# EAGLE design MCDU_Board (EAGLE 7.5.0)
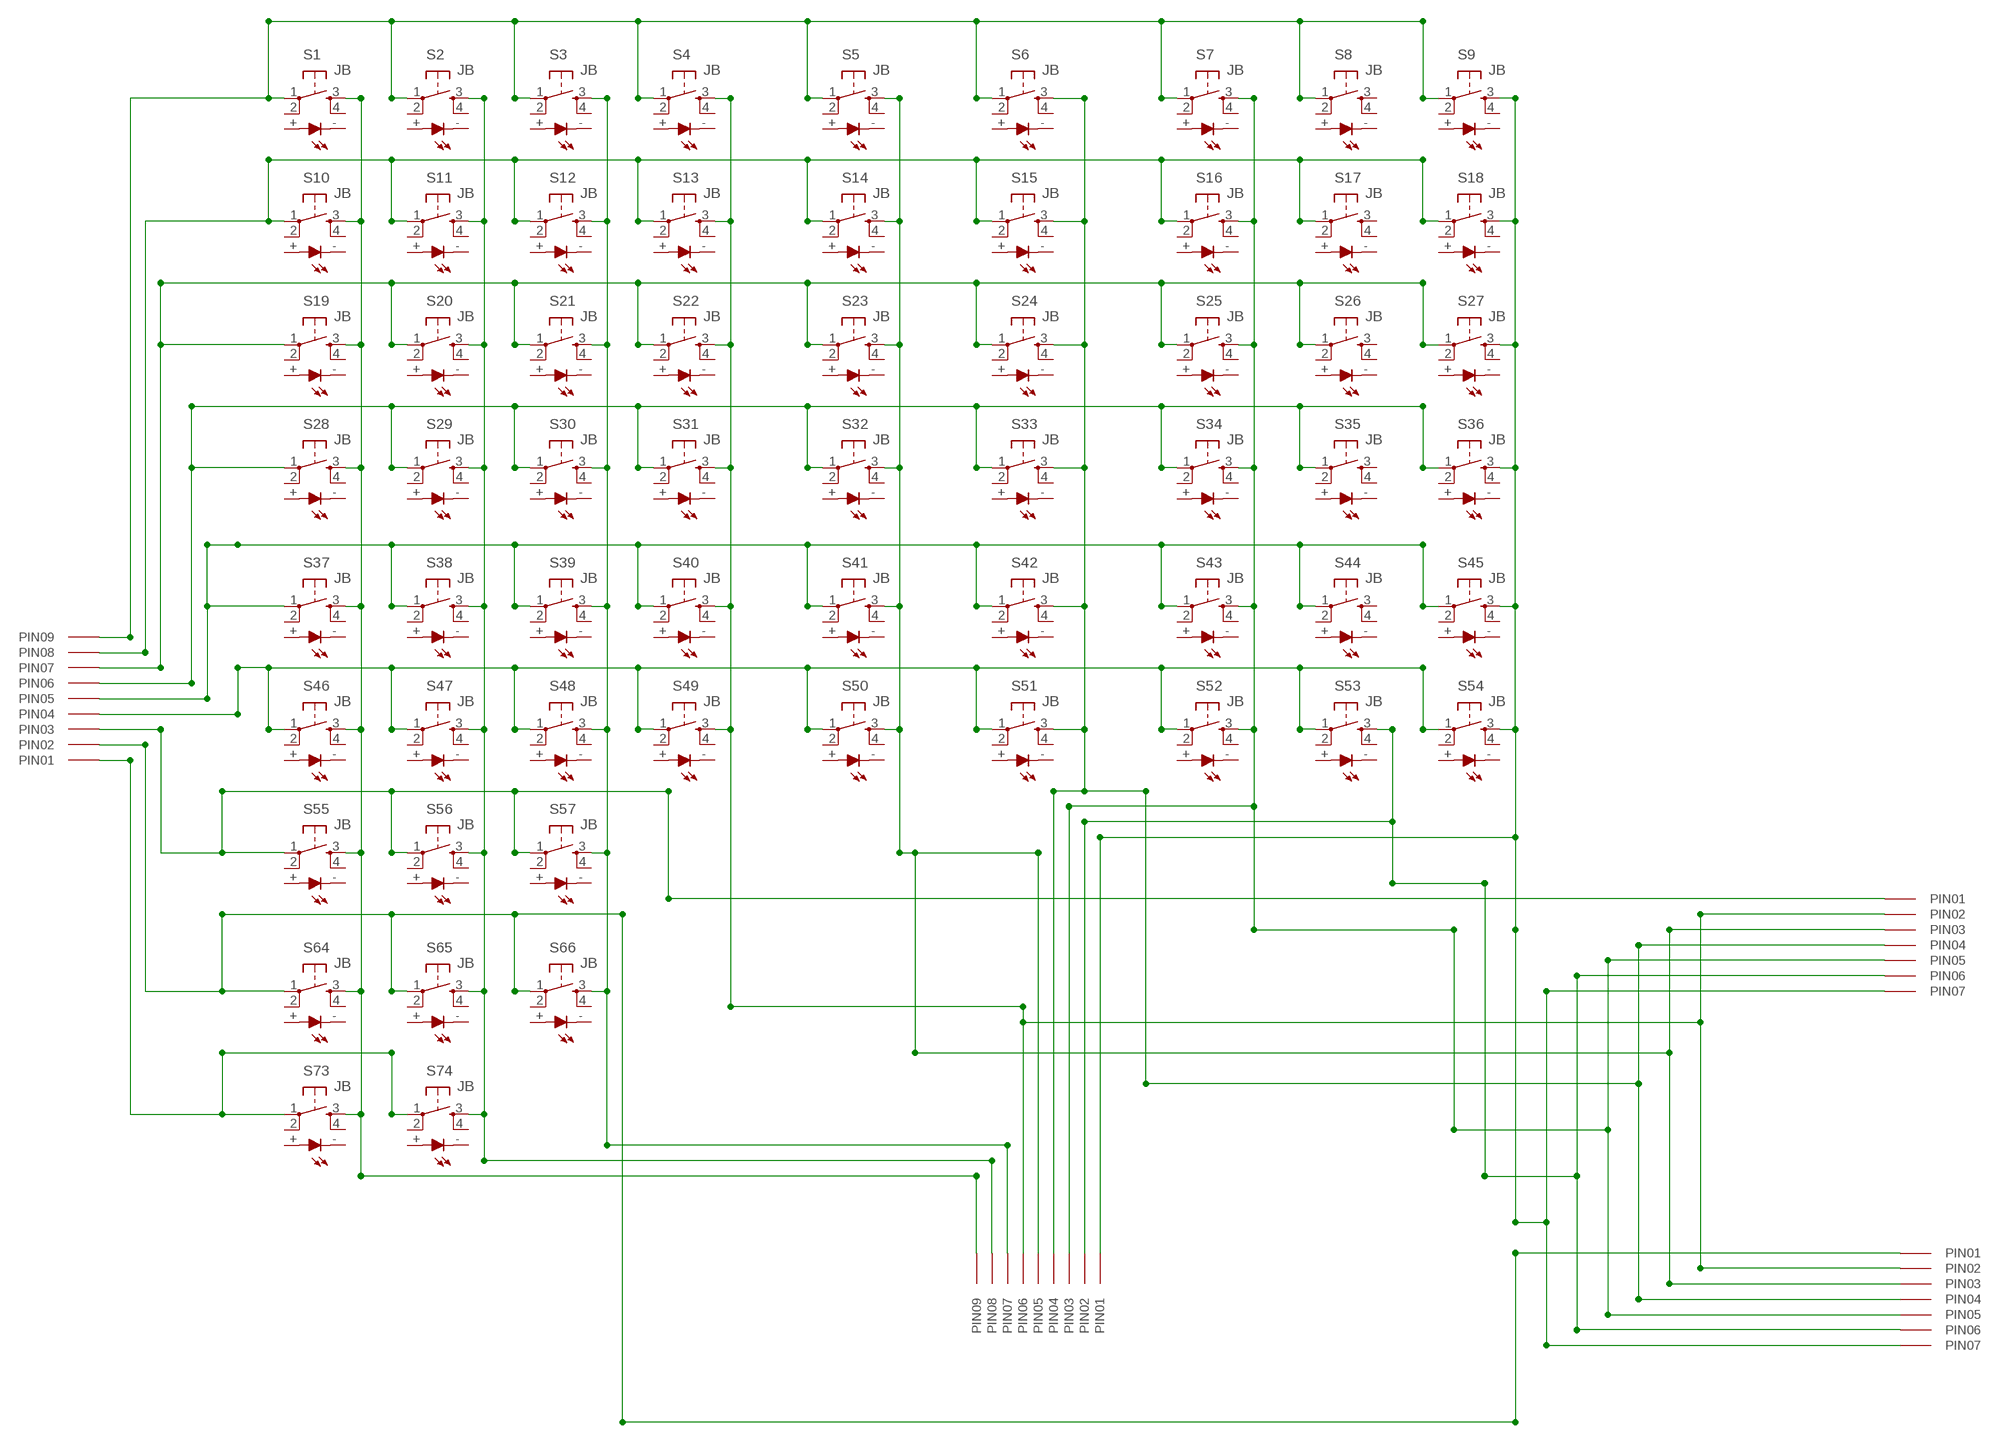
[diagram p0: schematic, sheet 1]

## Parts
S1  JB  [JB]
S2  JB  [JB]
S3  JB  [JB]
S4  JB  [JB]
S5  JB  [JB]
S6  JB  [JB]
S7  JB  [JB]
S8  JB  [JB]
S9  JB  [JB]
S10  JB  [JB]
S11  JB  [JB]
S12  JB  [JB]
S13  JB  [JB]
S14  JB  [JB]
S15  JB  [JB]
S16  JB  [JB]
S17  JB  [JB]
S18  JB  [JB]
S19  JB  [JB]
S20  JB  [JB]
S21  JB  [JB]
S22  JB  [JB]
S23  JB  [JB]
S24  JB  [JB]
S25  JB  [JB]
S26  JB  [JB]
S27  JB  [JB]
S28  JB  [JB]
S29  JB  [JB]
S30  JB  [JB]
S31  JB  [JB]
S32  JB  [JB]
S33  JB  [JB]
S34  JB  [JB]
S35  JB  [JB]
S36  JB  [JB]
S37  JB  [JB]
S38  JB  [JB]
S39  JB  [JB]
S40  JB  [JB]
S41  JB  [JB]
S42  JB  [JB]
S43  JB  [JB]
S44  JB  [JB]
S45  JB  [JB]
S46  JB  [JB]
S47  JB  [JB]
S48  JB  [JB]
S49  JB  [JB]
S50  JB  [JB]
S51  JB  [JB]
S52  JB  [JB]
S53  JB  [JB]
S54  JB  [JB]
S55  JB  [JB]
S56  JB  [JB]
S57  JB  [JB]
S64  JB  [JB]
S65  JB  [JB]
S66  JB  [JB]
S73  JB  [JB]
S74  JB  [JB]
U$1  09PINOS  [09PINOS]
U$2  07PINOS  [07PINOS]
U$3  07PINOS  [07PINOS]
U$4  09PINOS  [09PINOS]

## Nets
N$1: S1.1(P) S2.1(P) S3.1(P) S4.1(P) S5.1(P) S6.1(P) S7.1(P) S8.1(P) S9.1(P) U$1.PIN09
N$2: S10.1(P) S11.1(P) S12.1(P) S13.1(P) S14.1(P) S15.1(P) S16.1(P) S17.1(P) S18.1(P) U$1.PIN08
N$3: S19.1(P) S20.1(P) S21.1(P) S22.1(P) S23.1(P) S24.1(P) S25.1(P) S26.1(P) S27.1(P) U$1.PIN07
N$4: S28.1(P) S29.1(P) S30.1(P) S31.1(P) S32.1(P) S33.1(P) S34.1(P) S35.1(P) S36.1(P) U$1.PIN06
N$5: S37.1(P) S38.1(P) S39.1(P) S40.1(P) S41.1(P) S42.1(P) S43.1(P) S44.1(P) S45.1(P) U$1.PIN05
N$6: S46.1(P) S47.1(P) S48.1(P) S49.1(P) S50.1(P) S51.1(P) S52.1(P) S53.1(P) S54.1(P) U$1.PIN04
N$8: S1.3(S) S10.3(S) S19.3(S) S28.3(S) S37.3(S) S46.3(S) S55.3(S) S64.3(S) S73.3(S) U$4.PIN09
N$9: S73.1(P) S74.1(P) U$1.PIN01
N$11: S2.3(S) S11.3(S) S20.3(S) S29.3(S) S38.3(S) S47.3(S) S56.3(S) S65.3(S) S74.3(S) U$4.PIN08
N$12: S3.3(S) S12.3(S) S21.3(S) S30.3(S) S39.3(S) S48.3(S) S57.3(S) S66.3(S) U$4.PIN07
N$13: S4.3(S) S13.3(S) S22.3(S) S31.3(S) S40.3(S) S49.3(S) U$2.PIN02 U$3.PIN02 U$4.PIN06
N$14: S5.3(S) S14.3(S) S23.3(S) S32.3(S) S41.3(S) S50.3(S) U$2.PIN03 U$3.PIN03 U$4.PIN05
N$16: S7.3(S) S16.3(S) S25.3(S) S34.3(S) S43.3(S) S52.3(S) U$2.PIN05 U$3.PIN05 U$4.PIN03
N$17: S53.3(S) U$2.PIN06 U$3.PIN06 U$4.PIN02
N$18: S9.3(S) S18.3(S) S27.3(S) S36.3(S) S45.3(S) S54.3(S) U$2.PIN07 U$3.PIN07 U$4.PIN01
N$19: S64.1(P) S65.1(P) S66.1(P) U$1.PIN02 U$3.PIN01
N$22: S6.3(S) S15.3(S) S24.3(S) S33.3(S) S42.3(S) S51.3(S) U$2.PIN04 U$3.PIN04 U$4.PIN04
N$26: S55.1(P) S56.1(P) S57.1(P) U$1.PIN03 U$2.PIN01
Unconnected: S1.2(P1) S1.4(S1) S1.+(A) S1.-(C) S2.2(P1) S2.4(S1) S2.+(A) S2.-(C) S3.2(P1) S3.4(S1) S3.+(A) S3.-(C) S4.2(P1) S4.4(S1) S4.+(A) S4.-(C) S5.2(P1) S5.4(S1) S5.+(A) S5.-(C) S6.2(P1) S6.4(S1) S6.+(A) S6.-(C) S7.2(P1) S7.4(S1) S7.+(A) S7.-(C) S8.2(P1) S8.3(S) S8.4(S1) S8.+(A) S8.-(C) S9.2(P1) S9.4(S1) S9.+(A) S9.-(C) S10.2(P1) S10.4(S1) S10.+(A) S10.-(C) S11.2(P1) S11.4(S1) S11.+(A) S11.-(C) S12.2(P1) S12.4(S1) S12.+(A) S12.-(C) S13.2(P1) S13.4(S1) S13.+(A) S13.-(C) S14.2(P1) S14.4(S1) S14.+(A) S14.-(C) S15.2(P1) S15.4(S1) S15.+(A) S15.-(C) S16.2(P1) S16.4(S1) S16.+(A) S16.-(C) S17.2(P1) S17.3(S) S17.4(S1) S17.+(A) S17.-(C) S18.2(P1) S18.4(S1) S18.+(A) S18.-(C) S19.2(P1) S19.4(S1) S19.+(A) S19.-(C) S20.2(P1) S20.4(S1) S20.+(A) S20.-(C) S21.2(P1) S21.4(S1) S21.+(A) S21.-(C) S22.2(P1) S22.4(S1) S22.+(A) S22.-(C) S23.2(P1) S23.4(S1) S23.+(A) S23.-(C) S24.2(P1) S24.4(S1) S24.+(A) S24.-(C) S25.2(P1) S25.4(S1) S25.+(A) S25.-(C) S26.2(P1) S26.3(S) S26.4(S1) S26.+(A) S26.-(C) S27.2(P1) S27.4(S1) S27.+(A) S27.-(C) S28.2(P1) S28.4(S1) S28.+(A) S28.-(C) S29.2(P1) S29.4(S1) S29.+(A) S29.-(C) S30.2(P1) S30.4(S1) S30.+(A) S30.-(C) S31.2(P1) S31.4(S1) S31.+(A) S31.-(C) S32.2(P1) S32.4(S1) S32.+(A) S32.-(C) S33.2(P1) S33.4(S1) S33.+(A) S33.-(C) S34.2(P1) S34.4(S1) S34.+(A) S34.-(C) S35.2(P1) S35.3(S) S35.4(S1) S35.+(A) S35.-(C) S36.2(P1) S36.4(S1) S36.+(A) S36.-(C) S37.2(P1) S37.4(S1) S37.+(A) S37.-(C) S38.2(P1) S38.4(S1) S38.+(A) S38.-(C) S39.2(P1) S39.4(S1) S39.+(A) S39.-(C) S40.2(P1) S40.4(S1) S40.+(A) S40.-(C) S41.2(P1) S41.4(S1) S41.+(A) S41.-(C) S42.2(P1) S42.4(S1) S42.+(A) S42.-(C) S43.2(P1) S43.4(S1) S43.+(A) S43.-(C) S44.2(P1) S44.3(S) S44.4(S1) S44.+(A) S44.-(C) S45.2(P1) S45.4(S1) S45.+(A) S45.-(C) S46.2(P1) S46.4(S1) S46.+(A) S46.-(C) S47.2(P1) S47.4(S1) S47.+(A) S47.-(C) S48.2(P1) S48.4(S1) S48.+(A) S48.-(C) S49.2(P1) S49.4(S1) S49.+(A) S49.-(C) S50.2(P1) S50.4(S1) S50.+(A) S50.-(C) S51.2(P1) S51.4(S1) S51.+(A) S51.-(C) S52.2(P1) S52.4(S1) S52.+(A) S52.-(C) S53.2(P1) S53.4(S1) S53.+(A) S53.-(C) S54.2(P1) S54.4(S1) S54.+(A) S54.-(C) S55.2(P1) S55.4(S1) S55.+(A) S55.-(C) S56.2(P1) S56.4(S1) S56.+(A) S56.-(C) S57.2(P1) S57.4(S1) S57.+(A) S57.-(C) S64.2(P1) S64.4(S1) S64.+(A) S64.-(C) S65.2(P1) S65.4(S1) S65.+(A) S65.-(C) S66.2(P1) S66.4(S1) S66.+(A) S66.-(C) S73.2(P1) S73.4(S1) S73.+(A) S73.-(C) S74.2(P1) S74.4(S1) S74.+(A) S74.-(C)

## Library data of the parts
S1-S57 S64-S66 S73 S74 = switch-nkk:JB: JB Series - tact with LED backlight
U$1 U$4 = Arduino-clone:09PINOS
U$2 U$3 = Arduino-clone:07PINOS: 07 pinos

## Board
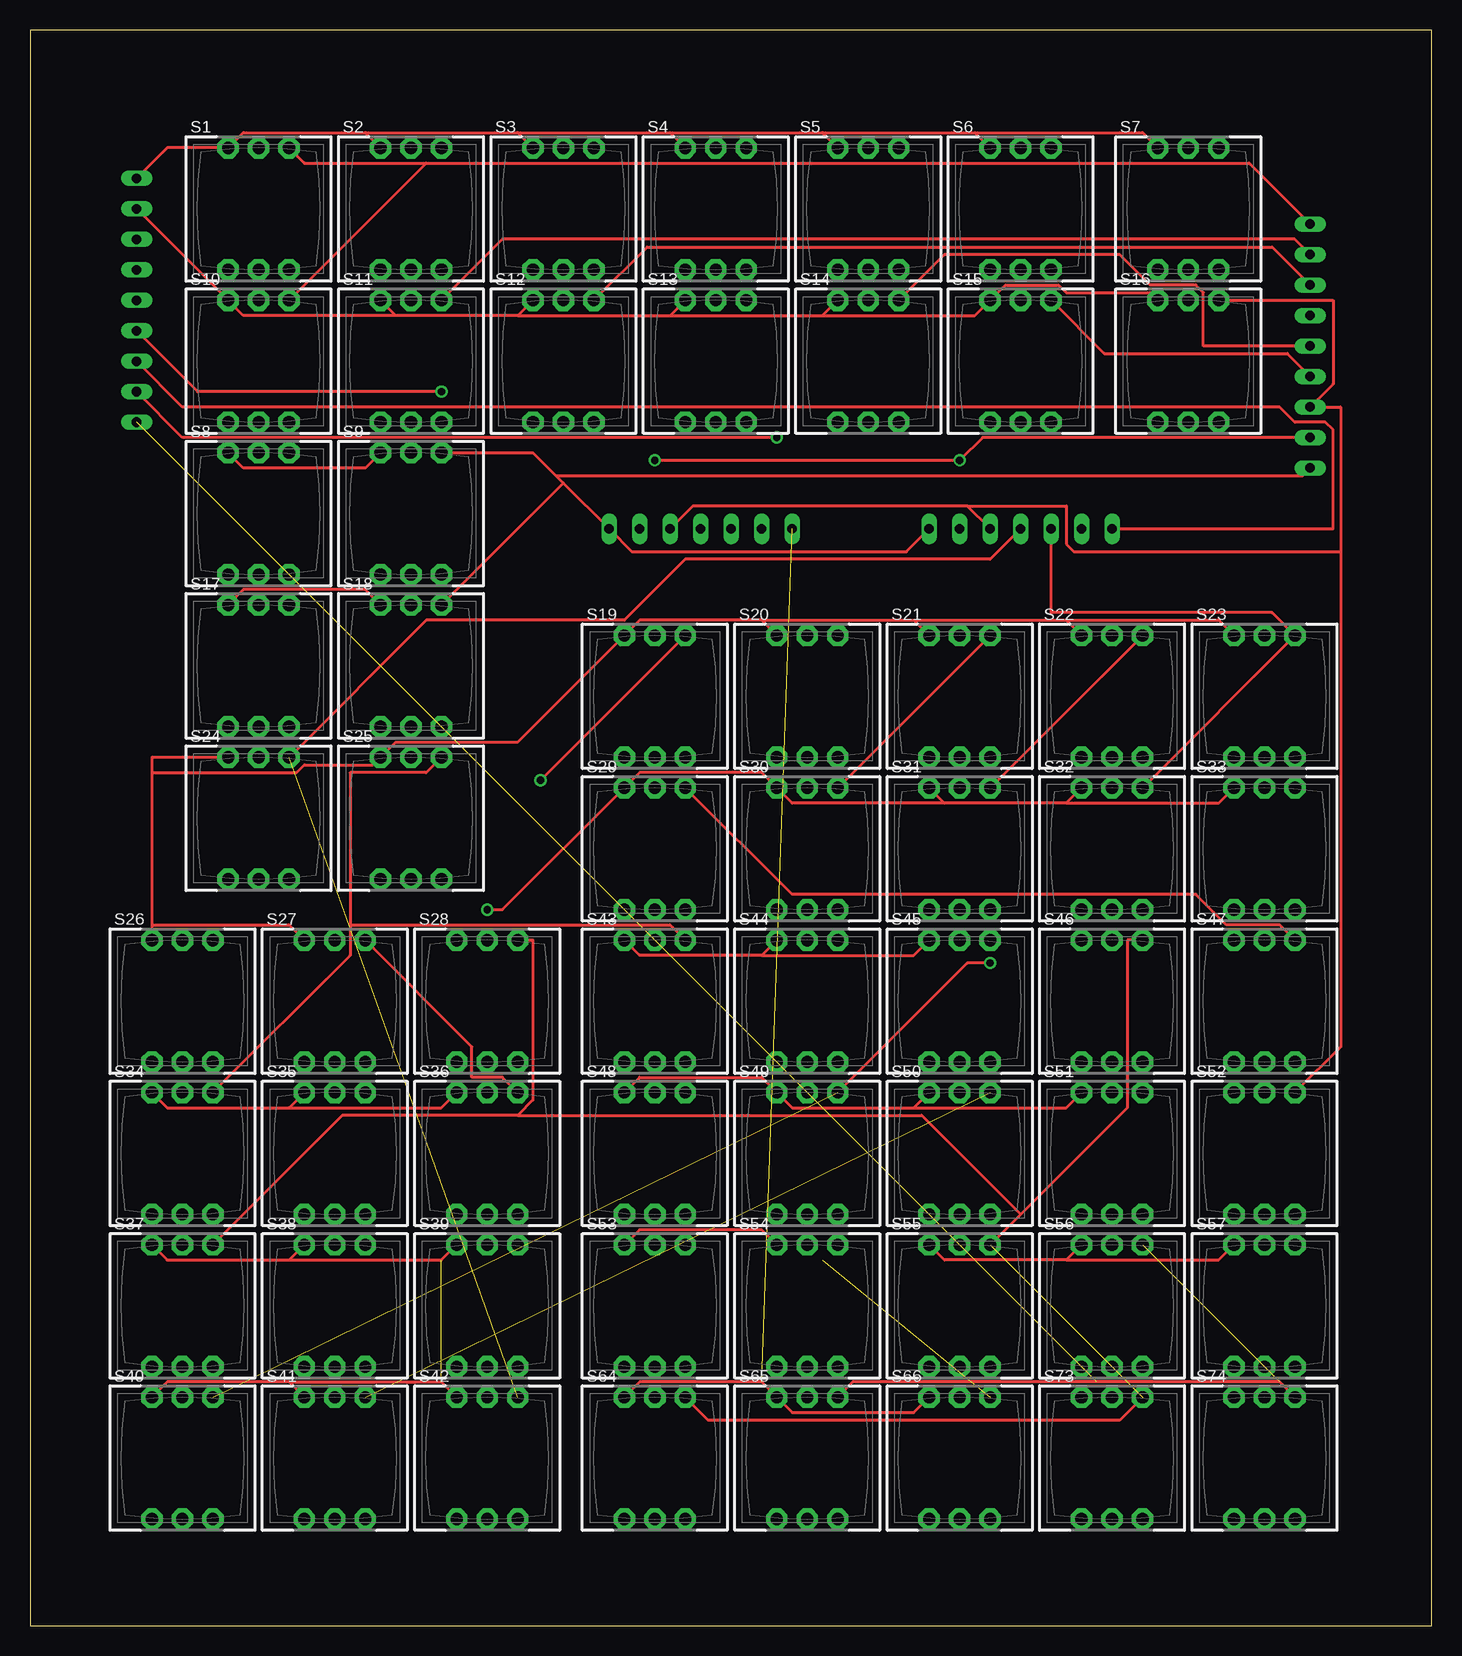
[diagram p1: board, top side]
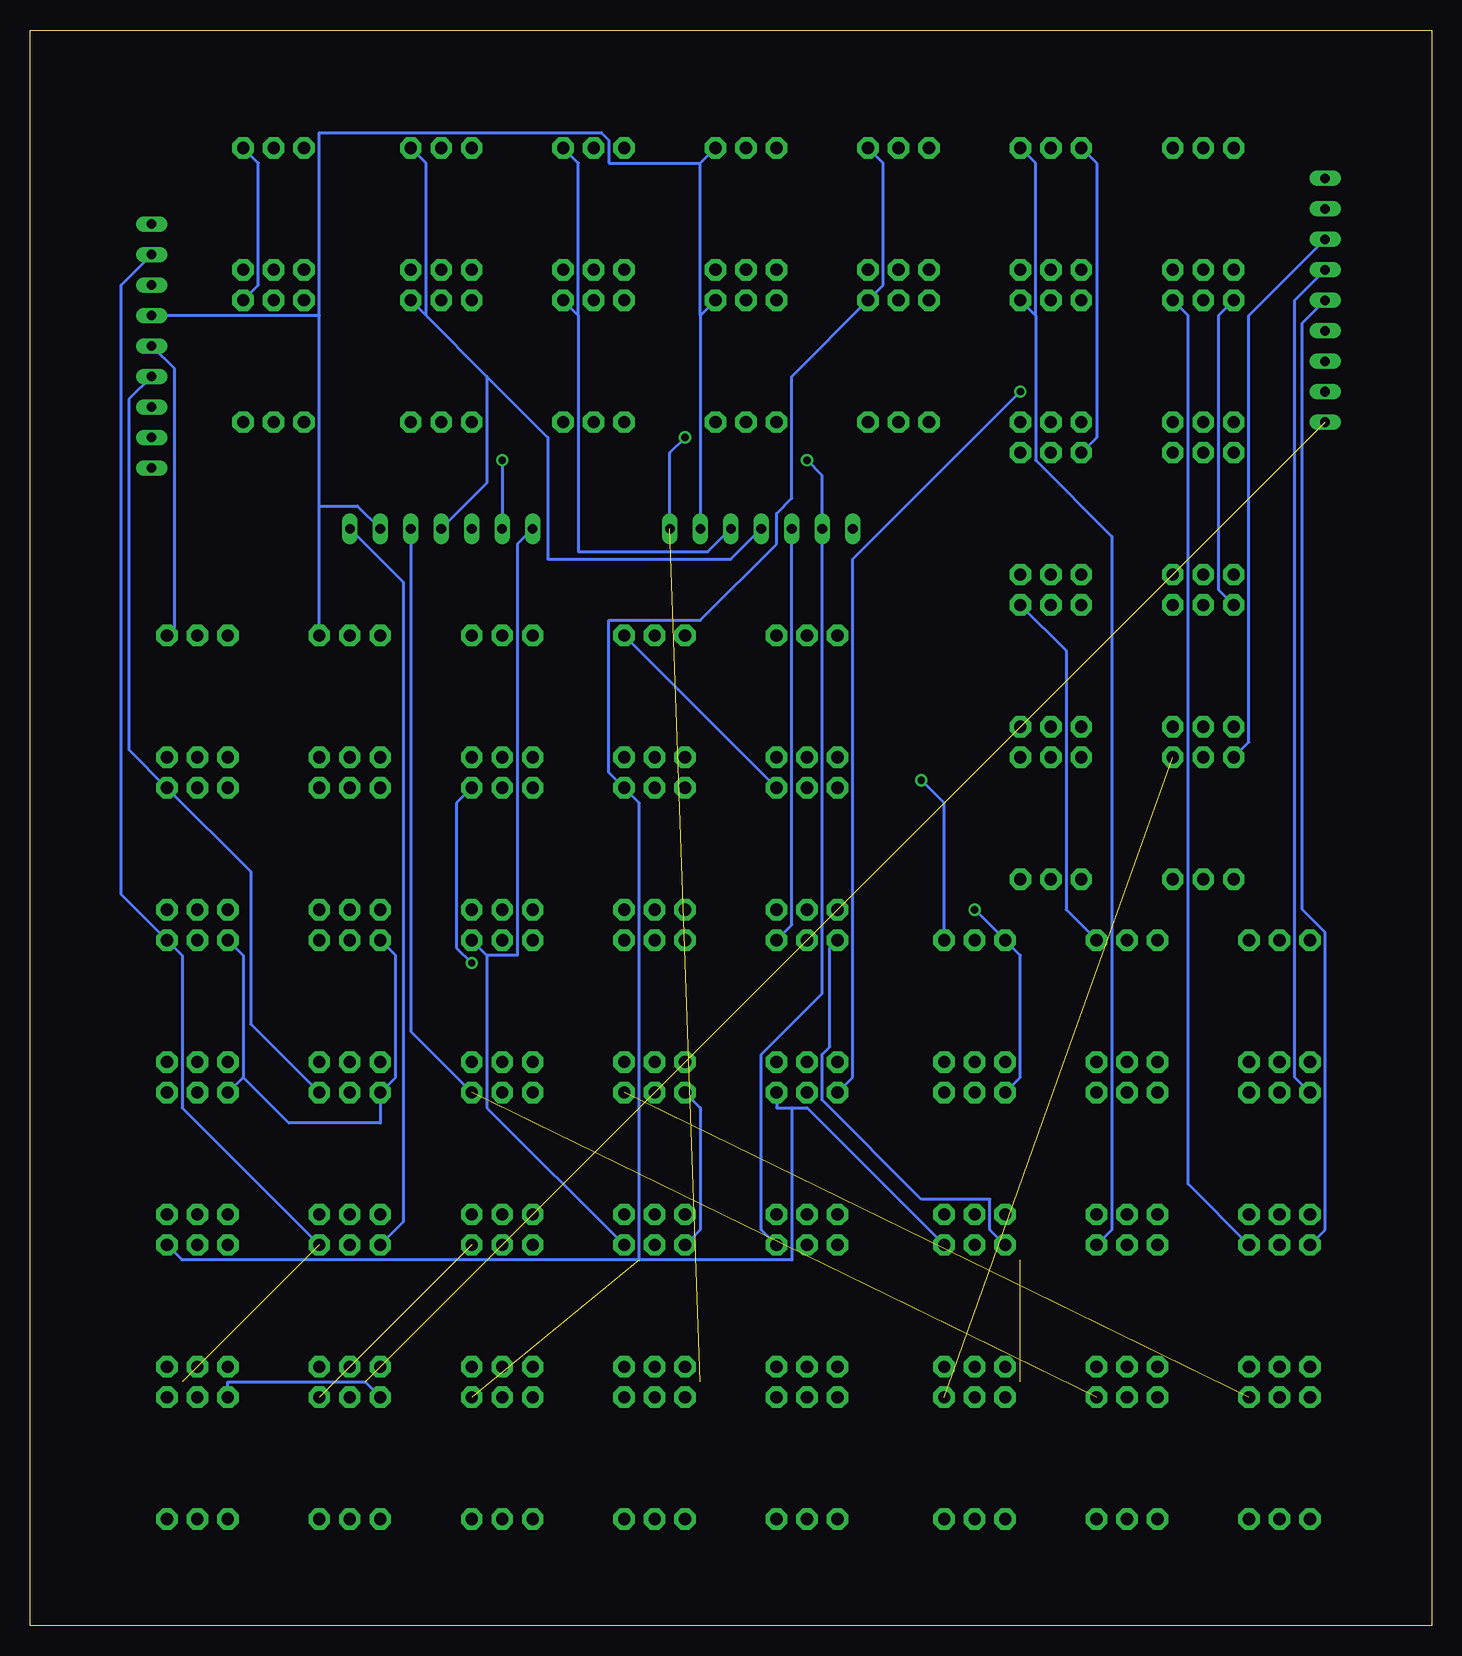
[diagram p2: board, bottom side, seen from below]

Size 116.82 x 133.02 mm. Coordinates in mm from the lower left corner, seen from the top.
Outline: 0,0 116.82,0 116.82,133.02 0,133.02 0,0
Copper layers (1*16): Top 0.035mm / dielectric 1.5mm / Bottom 0.035mm
Design rules "default": minimum track width 10mil, minimum drill 24mil, track to track 8mil, track to pad 8mil, pad to pad 8mil, via to via 8mil, smd to smd 8mil, copper to edge 40mil, drill to drill 8mil, minimum pad ring 10mil, minimum via ring 8mil, stop-mask expansion 4mil, vias tented up to drill 0mil, thermal gap 10mil

### Footprints (pad centres in the part's own frame; a part is rotated, then mirrored left to right if it is on the bottom)
JB = drill 1.016 pad 1.778 octagon: 1 -2.54,5.08; 2 -2.54,-5.08; 3 2.54,5.08; 4 2.54,-5.08; + 0,5.08; - 0,-5.08
09PINOS = drill 0.8 long: PIN01 -6.35,26.67; PIN02 -6.35,24.13; PIN03 -6.35,21.59; PIN04 -6.35,19.05; PIN05 -6.35,16.51; PIN06 -6.35,13.97; PIN07 -6.35,11.43; PIN08 -6.35,8.89; PIN09 -6.35,6.35
07PINOS = drill 0.8 long: PIN01 -6.35,26.67; PIN02 -6.35,24.13; PIN03 -6.35,21.59; PIN04 -6.35,19.05; PIN05 -6.35,16.51; PIN06 -6.35,13.97; PIN07 -6.35,11.43

### Placement (x,y rotation side)
S1  19.05,118.11 0 top
S2  31.75,118.11 0 top
S3  44.45,118.11 0 top
S4  57.15,118.11 0 top
S5  69.85,118.11 0 top
S6  82.55,118.11 0 top
S7  96.52,118.11 0 top
S8  19.05,92.71 0 top
S9  31.75,92.71 0 top
S10  19.05,105.41 0 top
S11  31.75,105.41 0 top
S12  44.45,105.41 0 top
S13  57.15,105.41 0 top
S14  69.85,105.41 0 top
S15  82.55,105.41 0 top
S16  96.52,105.41 0 top
S17  19.05,80.01 0 top
S18  31.75,80.01 0 top
S19  52.07,77.47 0 top
S20  64.77,77.47 0 top
S21  77.47,77.47 0 top
S22  90.17,77.47 0 top
S23  102.87,77.47 0 top
S24  19.05,67.31 0 top
S25  31.75,67.31 0 top
S26  12.7,52.07 0 top
S27  25.4,52.07 0 top
S28  38.1,52.07 0 top
S29  52.07,64.77 0 top
S30  64.77,64.77 0 top
S31  77.47,64.77 0 top
S32  90.17,64.77 0 top
S33  102.87,64.77 0 top
S34  12.7,39.37 0 top
S35  25.4,39.37 0 top
S36  38.1,39.37 0 top
S37  12.7,26.67 0 top
S38  25.4,26.67 0 top
S39  38.1,26.67 0 top
S40  12.7,13.97 0 top
S41  25.4,13.97 0 top
S42  38.1,13.97 0 top
S43  52.07,52.07 0 top
S44  64.77,52.07 0 top
S45  77.47,52.07 0 top
S46  90.17,52.07 0 top
S47  102.87,52.07 0 top
S48  52.07,39.37 0 top
S49  64.77,39.37 0 top
S50  77.47,39.37 0 top
S51  90.17,39.37 0 top
S52  102.87,39.37 0 top
S53  52.07,26.67 0 top
S54  64.77,26.67 0 top
S55  77.47,26.67 0 top
S56  90.17,26.67 0 top
S57  102.87,26.67 0 top
S64  52.07,13.97 0 top
S65  64.77,13.97 0 top
S66  77.47,13.97 0 top
S73  90.17,13.97 0 top
S74  102.87,13.97 0 top
U$1  2.54,127 180 top
U$2  63.5,85.09 270 top
U$3  36.83,85.09 270 top
U$4  100.33,123.19 180 top

### Tracks (layer width: path | path; a pad name or v marks a point on that pad's centre or on a via)
N$1
  Top 0.254: S8.1 17.78,96.52 27.94,96.52 S9.1 | U$1.PIN09 11.43,123.19 S1.1 17.78,124.46 27.94,124.46 | 27.94,124.46 S2.1 | 40.64,124.46 S3.1 | 27.94,124.46 40.64,124.46 | 53.34,124.46 S4.1 | 40.64,124.46 53.34,124.46 | 66.04,124.46 S5.1 | 53.34,124.46 66.04,124.46 | 78.74,124.46 S6.1 | 66.04,124.46 78.74,124.46 | S7.1 92.71,124.46 78.74,124.46
  Bottom 0.254: S9.1 27.94,99.06 27.94,121.92 S2.1
N$2
  Top 0.254: S17.1 17.78,86.36 27.94,86.36 S18.1 | U$1.PIN08 S10.1 17.78,109.22 30.48,109.22 | 30.48,109.22 S11.1 | 40.64,109.22 30.48,109.22 | S12.1 40.64,109.22 | 53.34,109.22 S13.1 | 40.64,109.22 53.34,109.22 | 66.04,109.22 S14.1 | 53.34,109.22 66.04,109.22 | 66.04,109.22 78.74,109.22 S15.1 81.28,111.76 85.72,111.76 86.36,111.12 93.34,111.12 S16.1
  Bottom 0.254: S17.1 17.78,86.36 17.78,109.22 S10.1
N$3
  Top 0.254: 60.96,83.82 50.8,83.82 S19.1 40.64,73.66 30.48,73.66 S25.1 28.58,71.75 22.86,71.75 22.23,71.12 10.16,71.12 | S20.1 60.96,83.82 | 73.66,83.82 S21.1 | 60.96,83.82 73.66,83.82 | 86.36,83.82 S22.1 | 73.66,83.82 86.36,83.82 | S23.1 99.06,83.82 86.36,83.82 | 10.16,71.12 10.16,72.39 S24.1 | 10.16,71.12 10.16,58.42 | 10.16,58.42 S26.1 | S27.1 21.59,58.42 10.16,58.42
  Bottom 0.254: U$1.PIN07 15.24,109.22 15.24,73.66 S24.1
N$4  (via drill 0.61)
  Top 0.254: 76.2,68.58 S31.1 | 86.36,68.58 76.2,68.58 | S32.1 86.36,68.58 | S33.1 99.06,68.58 86.36,68.58 | 76.2,68.58 63.5,68.58 S30.1 60.96,71.12 50.8,71.12 S29.1 39.37,59.69 v38.1,59.69 | 21.59,43.18 S35.1 | 21.59,43.18 11.43,43.18 S34.1 | S36.1 34.29,43.18 21.59,43.18
  Bottom 0.254: U$1.PIN06 11.43,110.49 11.43,45.72 S34.1 | S36.1 34.29,45.72 34.29,55.88 S28.1 v38.1,59.69
N$5  (1 unrouted)
  Top 0.254: S40.1 11.43,20.32 21.59,20.32 | S41.1 21.59,20.32 | S42.1 34.29,20.32 21.59,20.32 | S43.1 50.8,55.88 60.96,55.88 | S44.1 60.96,55.88 | S45.1 73.66,55.88 60.96,55.88 | 21.59,30.48 S38.1 | 21.59,30.48 11.43,30.48 S37.1 | S39.1 34.29,30.48 21.59,30.48
  Bottom 0.254: U$1.PIN05 10.79,108.59 10.79,59.69 8.89,57.78 8.89,33.02 S37.1 | S43.1 50.16,56.52 50.16,48.26 50.8,47.62 50.8,43.81 42.55,35.56 36.83,35.56 36.83,33.02 S39.1
N$6  (via drill 0.61)
  Top 0.254: S53.1 50.8,33.02 60.96,33.02 S54.1 | U$1.PIN04 13.97,102.87 v34.29,102.87 | S48.1 50.8,45.72 60.96,45.72 S49.1 63.5,43.18 73.66,43.18 | 73.66,43.18 S50.1 | S51.1 86.36,43.18 73.66,43.18
  Bottom 0.254: 99.06,45.72 S52.1 | 99.06,45.72 99.06,55.88 S47.1 | v34.29,102.87 48.26,88.9 48.26,45.72 S48.1 | S46.1 86.36,55.88 86.36,45.72 S51.1 87.63,41.91 95.25,41.91 99.06,45.72 | S54.1 60.96,33.02 60.96,43.18 S49.1
N$8  (via drill 0.61)  (1 unrouted)
  Top 0.254: S64.3 56.52,17.15 90.8,17.15 S73.3 | U$4.PIN09 101.6,121.92 33.02,121.92 | 33.02,121.92 22.86,121.92 S1.3 | 33.02,121.92 S10.3 | 82.55,34.29 91.44,43.18 91.44,57.15 S46.3 | 82.55,34.29 S55.3 | S37.3 26.03,42.55 40.64,42.55 | 40.64,42.55 41.91,43.81 41.91,57.15 S28.3 | v42.55,70.48 S19.3 | 82.55,34.29 74.29,42.55 40.64,42.55
  Bottom 0.254: v42.55,70.48 40.64,68.58 S28.3 | S10.3 20.32,109.22 20.32,36.83 S37.3
N$9  (1 unrouted)
  Bottom 0.254: S73.1 88.9,20.32 100.33,20.32 S74.1
N$11  (1 unrouted)
  Top 0.254: S65.3 68.58,20.32 104.14,20.32 S74.3 | S29.3 63.5,60.96 97.16,60.96 99.69,58.42 104.14,58.42 S47.3 | S11.3 39.37,115.57 105.41,115.57 U$4.PIN08
  Bottom 0.254: S38.3 26.67,33.02 26.67,90.81 33.02,97.16 33.02,109.22 | S11.3 33.02,109.22 | S2.3 33.02,121.92 33.02,109.22 | S20.3 S29.3 | U$4.PIN08 109.22,111.76 109.22,60.96 S47.3 104.14,55.88 104.14,43.18 S56.3
N$12  (1 unrouted)
  Top 0.254: U$4.PIN07 103.5,114.94 51.44,114.94 S12.3 | S21.3 S30.3
  Bottom 0.254: S3.3 45.72,121.92 45.72,111.76 S12.3 53.34,104.14 53.34,93.98 54.61,92.71 54.61,90.17 60.96,83.82 68.58,83.82 68.58,71.12 S30.3 66.04,68.58 66.04,30.48 | S39.3 52.07,43.18 53.34,43.18 | 53.34,43.18 54.61,43.18 S48.3 | S57.3 104.14,30.48 66.04,30.48 | 66.04,30.48 53.34,30.48 53.34,43.18
N$13  (via drill 0.61)  (1 unrouted)
  Top 0.254: S49.3 78.1,55.25 v80.01,55.25 | S22.3 S31.3
  Bottom 0.254: v80.01,55.25 81.28,56.52 81.28,68.58 S31.3 | 60.96,109.22 U$3.PIN02 | S13.3 60.96,109.22 | 60.96,121.92 S4.3 | 60.96,109.22 60.96,121.92 | U$2.PIN02 89.53,93.34 92.71,93.34 | S22.3 92.71,93.34 | 92.71,109.22 U$4.PIN06 | 92.71,93.34 92.71,109.22 | 60.96,121.92 68.58,121.92 68.58,123.82 69.22,124.46 92.71,124.46 92.71,109.22
N$14  (1 unrouted)
  Top 0.254: U$2.PIN03 85.09,84.45 103.5,84.45 S23.3 S32.3 | S14.3 76.2,114.3 90.8,114.3 93.34,111.76 97.16,111.76 97.79,111.12 97.79,106.68 U$4.PIN05
  Bottom 0.254: U$3.PIN03 60.33,89.53 71.12,89.53 71.12,109.22 | S14.3 71.12,109.22 | S5.3 71.12,121.92 71.12,109.22 | U$4.PIN05 104.77,104.78 104.77,83.19 S23.3 | S50.3 85.09,49.53 U$2.PIN03
N$16
  Top 0.254: S16.3 108.58,110.49 108.58,103.5 U$4.PIN03 109.22,101.6 109.22,89.53 | S52.3 109.22,48.26 109.22,89.53 | U$3.PIN05 55.25,93.34 78.1,93.34 | U$2.PIN05 78.1,93.34 | S34.3 26.67,55.88 26.67,58.42 | 26.67,58.42 26.67,71.12 33.02,71.12 S25.3 | S43.3 53.34,58.42 26.67,58.42 | 109.22,89.53 86.99,89.53 86.36,90.17 86.36,93.34 78.1,93.34
  Bottom 0.254: S7.3 97.79,121.92 97.79,111.76 S16.3 | U$3.PIN05 53.34,58.42 S43.3
N$17  (via drill 0.61)
  Top 0.254: U$4.PIN02 79.38,99.06 v77.47,97.16 v52.07,97.16
  Bottom 0.254: v77.47,97.16 U$2.PIN06 | S53.3 55.88,33.02 55.88,47.62 50.8,52.7 U$3.PIN06 50.8,95.88 v52.07,97.16
N$18
  Top 0.254: S27.3 36.83,48.26 36.83,45.72 39.37,45.72 S36.3 | 43.82,95.88 41.91,97.79 S9.3 | 43.82,95.88 44.45,95.25 | 44.45,95.25 U$3.PIN07 50.16,89.53 73.02,89.53 U$2.PIN07 | U$4.PIN01 106.04,95.88 43.82,95.88 | 44.45,95.25 S18.3
  Bottom 0.254: S54.3 78.74,43.18 78.74,55.88 | S45.3 78.74,55.88 | S27.3 30.48,59.69 30.48,81.28 S18.3 | 78.74,55.88 76.2,55.88 76.2,90.17 U$2.PIN07
N$19  (via drill 0.61)  (1 unrouted)
  Top 0.254: S64.1 50.8,20.32 60.96,20.32 S65.1 63.5,17.78 73.66,17.78 S66.1 | U$1.PIN02 12.7,99.06 v62.23,99.06
  Bottom 0.254: v62.23,99.06 63.5,97.79 U$3.PIN01
N$22  (1 unrouted)
  Top 0.254: U$4.PIN04 104.77,106.04 89.53,106.04 S15.3 | S24.3 33.02,83.82 49.53,83.82 54.61,88.9 80.01,88.9 U$2.PIN04
  Bottom 0.254: S51.3 98.42,50.16 98.42,62.87 S33.3 108.58,73.03 108.58,102.24 U$4.PIN04 | U$3.PIN04 58.42,88.9 73.66,88.9 73.66,99.06 78.74,104.14 | S15.3 83.82,109.22 | 83.82,109.22 78.74,104.14 | U$2.PIN04 78.74,95.25 78.74,104.14 | S6.3 83.82,121.92 83.82,109.22
N$26
  Top 0.254: S55.1 76.2,30.48 86.36,30.48 | S56.1 86.36,30.48 | S57.1 99.06,30.48 86.36,30.48 | U$1.PIN03 12.7,101.6 104.14,101.6 105.41,100.33 107.95,100.33 108.58,99.69 108.58,91.44 U$2.PIN01
  Bottom 0.254: S56.1 85.72,33.66 85.72,87 U$2.PIN01